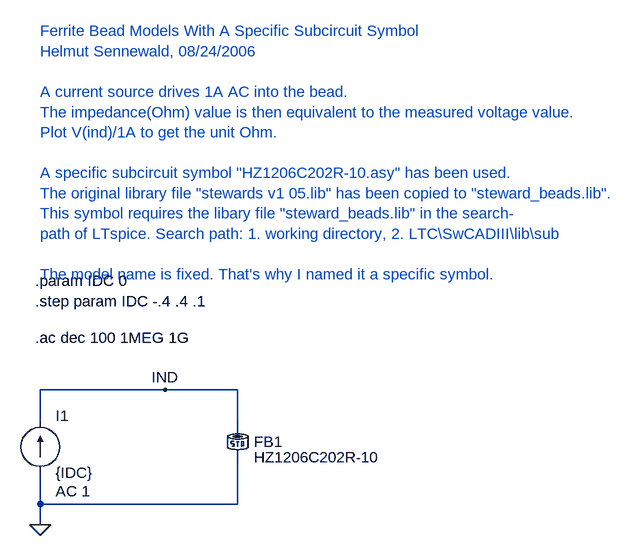
[diagram p0: schematic ferritebead_test2s.asc]
ferritebead_test2s.asc, the LTspice schematic file:
Version 4
SHEET 1 1144 680
WIRE 64 64 -128 64
WIRE 176 64 64 64
WIRE -128 112 -128 64
WIRE 176 112 176 64
WIRE -128 240 -128 192
WIRE 176 240 176 176
WIRE 176 240 -128 240
WIRE -128 272 -128 240
FLAG -128 272 0
FLAG 64 64 IND
SYMBOL current -128 192 M180
WINDOW 0 24 88 Left 0
WINDOW 3 24 0 Left 0
WINDOW 123 24 -28 Left 0
WINDOW 39 0 0 Left 0
SYMATTR InstName I1
SYMATTR Value {IDC}
SYMATTR Value2 AC 1
SYMBOL HZ1206CC202R-10 176 144 R0
SYMATTR InstName FB1
TEXT -136 -72 Left 0 !.step param IDC -.4 .4 .1
TEXT -136 -16 Left 0 !.ac dec 100 1MEG 1G
TEXT -136 -104 Left 0 !.param IDC 0
TEXT -128 -488 Left 0 ;Ferrite Bead Models With A Specific Subcircuit Symbol\nHelmut Sennewald, 08/24/2006\n \nA current source drives 1A AC into the bead.\nThe impedance(Ohm) value is then equivalent to the measured voltage value.\nPlot V(ind)/1A to get the unit Ohm.\n \nA specific subcircuit symbol "HZ1206C202R-10.asy" has been used.\nThe original library file "stewards v1 05.lib" has been copied to "steward_beads.lib".\nThis symbol requires the libary file "steward_beads.lib" in the search-\npath of LTspice. Search path: 1. working directory, 2. LTC\\SwCADIII\\lib\\sub \n \nThe model name is fixed. That's why I named it a specific symbol.

The netlist it stands for:
* ferritebead_test2s.asc
I1 0 IND {IDC} AC 1
XFB1 IND 0 HZ1206C202R-10  ; pins A B
.step param IDC -.4 .4 .1
.ac dec 100 1MEG 1G
.param IDC 0
* Ferrite Bead Models With A Specific Subcircuit Symbol
* Helmut Sennewald, 08/24/2006
* A current source drives 1A AC into the bead.
* The impedance(Ohm) value is then equivalent to the measured voltage value.
* Plot V(ind)/1A to get the unit Ohm.
* A specific subcircuit symbol "HZ1206C202R-10.asy" has been used.
* The original library file "stewards v1 05.lib" has been copied to "steward_beads.lib".
* This symbol requires the libary file "steward_beads.lib" in the search-
* path of LTspice. Search path: 1. working directory, 2. LTC\SwCADIII\lib\sub
* The model name is fixed. That's why I named it a specific symbol.
.lib steward_beads.lib
.backanno
.end